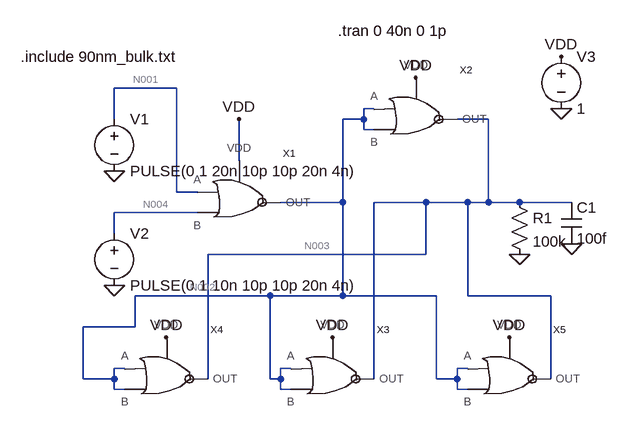
[diagram p0: schematic 1_exp3.asc]
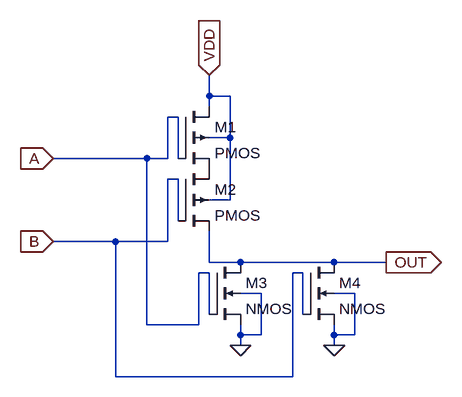
[diagram p1: sub-circuit nor.asc]
1_exp3.asc, the LTspice schematic file:
Version 4
SHEET 1 880 680
WIRE -80 32 -176 32
WIRE 224 64 208 64
WIRE -176 80 -176 32
WIRE 208 80 208 64
WIRE 208 80 176 80
WIRE 400 80 352 80
WIRE 208 96 208 80
WIRE 224 96 208 96
WIRE 16 144 16 80
WIRE -80 192 -80 32
WIRE -48 192 -80 192
WIRE 176 208 176 80
WIRE 176 208 80 208
WIRE 304 208 224 208
WIRE 368 208 304 208
WIRE 400 208 400 80
WIRE 400 208 368 208
WIRE 448 208 400 208
WIRE 528 208 448 208
WIRE -48 224 -176 224
WIRE -176 256 -176 224
WIRE 304 288 304 208
WIRE 304 288 -32 288
WIRE 64 352 -144 352
WIRE 176 352 176 208
WIRE 176 352 64 352
WIRE 320 352 176 352
WIRE 368 352 368 208
WIRE 496 352 368 352
WIRE -144 400 -144 352
WIRE -144 400 -224 400
WIRE -160 464 -176 464
WIRE 96 464 80 464
WIRE 368 464 352 464
WIRE -224 480 -224 400
WIRE -176 480 -176 464
WIRE -176 480 -224 480
WIRE -32 480 -32 288
WIRE 64 480 64 352
WIRE 80 480 80 464
WIRE 80 480 64 480
WIRE 224 480 224 208
WIRE 320 480 320 352
WIRE 352 480 352 464
WIRE 352 480 320 480
WIRE 496 480 496 352
WIRE -176 496 -176 480
WIRE -160 496 -176 496
WIRE 80 496 80 480
WIRE 96 496 80 496
WIRE 352 496 352 480
WIRE 368 496 352 496
FLAG -176 336 0
FLAG -176 160 0
FLAG 16 80 VDD
FLAG 448 288 0
FLAG 528 272 0
FLAG 512 64 0
FLAG 512 -16 VDD
FLAG 288 16 VDD
FLAG -96 416 VDD
FLAG 160 416 VDD
FLAG 432 416 VDD
SYMBOL nor 16 208 R0
SYMATTR InstName X1
SYMBOL voltage -176 64 R0
WINDOW 123 0 0 Left 2
WINDOW 39 0 0 Left 2
SYMATTR InstName V1
SYMATTR Value PULSE(0 1 20n 10p 10p 20n 4n)
SYMBOL voltage -176 240 R0
WINDOW 123 0 0 Left 2
WINDOW 39 0 0 Left 2
SYMATTR InstName V2
SYMATTR Value PULSE(0 1 10n 10p 10p 20n 4n)
SYMBOL res 432 192 R0
SYMATTR InstName R1
SYMATTR Value 100k
SYMBOL cap 512 208 R0
SYMATTR InstName C1
SYMATTR Value 100f
SYMBOL voltage 512 -32 R0
WINDOW 123 0 0 Left 2
WINDOW 39 0 0 Left 2
SYMATTR InstName V3
SYMATTR Value 1
SYMBOL nor 288 80 R0
SYMATTR InstName X2
SYMBOL nor 160 480 R0
SYMATTR InstName X3
SYMBOL nor -96 480 R0
SYMATTR InstName X4
SYMBOL nor 432 480 R0
SYMATTR InstName X5
TEXT -320 -16 Left 2 !.include 90nm_bulk.txt
TEXT 168 -56 Left 2 !.tran 0 40n 0 1p

nor.asc, the sub-circuit schematic file:
Version 4
SHEET 1 880 680
WIRE 352 0 352 -32
WIRE 384 0 352 0
WIRE 352 16 352 0
WIRE 304 32 288 32
WIRE 384 64 384 0
WIRE 384 64 352 64
WIRE 256 96 112 96
WIRE 288 96 288 32
WIRE 288 96 256 96
WIRE 304 96 304 32
WIRE 304 128 288 128
WIRE 384 160 384 64
WIRE 384 160 352 160
WIRE 304 192 304 128
WIRE 208 224 112 224
WIRE 288 224 288 128
WIRE 288 224 208 224
WIRE 352 256 352 208
WIRE 400 256 352 256
WIRE 544 256 400 256
WIRE 624 256 544 256
WIRE 352 272 336 272
WIRE 496 272 480 272
WIRE 432 304 400 304
WIRE 576 304 544 304
WIRE 352 336 352 272
WIRE 496 336 496 272
WIRE 256 352 256 96
WIRE 336 352 336 272
WIRE 336 352 256 352
WIRE 400 368 400 352
WIRE 432 368 432 304
WIRE 432 368 400 368
WIRE 544 368 544 352
WIRE 576 368 576 304
WIRE 576 368 544 368
WIRE 400 384 400 368
WIRE 544 384 544 368
WIRE 208 432 208 224
WIRE 480 432 480 272
WIRE 480 432 208 432
FLAG 352 -32 VDD
IOPIN 352 -32 In
FLAG 400 384 0
FLAG 544 384 0
FLAG 624 256 OUT
IOPIN 624 256 Out
FLAG 112 96 A
IOPIN 112 96 In
FLAG 112 224 B
IOPIN 112 224 In
SYMBOL pmos4 304 16 R0
SYMATTR InstName M1
SYMATTR Value2 l=90n w=400n
SYMBOL pmos4 304 112 R0
SYMATTR InstName M2
SYMATTR Value2 l=90n w=400n
SYMBOL nmos4 352 256 R0
SYMATTR InstName M3
SYMATTR Value2 l=90n w=200n
SYMBOL nmos4 496 256 R0
SYMATTR InstName M4
SYMATTR Value2 l=90n w=200n

The netlist it stands for:
* 1_exp3.asc
XX1 N001 N004 N002 VDD nor
V1 N001 0 PULSE(0 1 20n 10p 10p 20n 4n)
V2 N004 0 PULSE(0 1 10n 10p 10p 20n 4n)
R1 N003 0 100k
C1 N003 0 100f
V3 VDD 0 1
XX2 N002 N002 N003 VDD nor
XX3 N002 N002 N003 VDD nor
XX4 N002 N002 N003 VDD nor
XX5 N002 N002 N003 VDD nor

* block symbol definitions
.subckt nor A B OUT VDD
M1 VDD A P001 VDD PMOS l=90n w=400n
M2 P001 B OUT VDD PMOS l=90n w=400n
M3 OUT A 0 0 NMOS l=90n w=200n
M4 OUT B 0 0 NMOS l=90n w=200n
.ends nor

.model NMOS NMOS
.model PMOS PMOS
.lib standard.mos
.include 90nm_bulk.txt
.tran 0 40n 0 1p
.backanno
.end

* Results of the author's LTspice run, read from the files saved beside the schematic
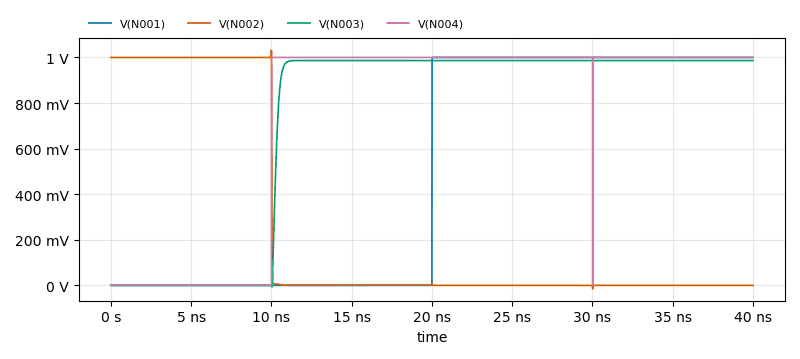
[diagram p2: Transient Analysis of 1_exp3.asc, plotted from the saved traces]
* Transient Analysis, 1 run:
*   V(N001): min 0 V, max 1 V, average 499.9 mV, rms 707 mV, last 1 V
*   V(N002): min -15.12 mV, max 1.031 V, average 250.9 mV, rms 500.6 mV, last 1.123 µV
*   V(N003): min -6.641 mV, max 986.8 mV, average 732.2 mV, rms 848.3 mV, last 986.2 mV
*   V(N004): min 0 V, max 1 V, average 749.6 mV, rms 865.7 mV, last 1 V